# EAGLE design VelcheckPSI_G2 (EAGLE 9.6.2)
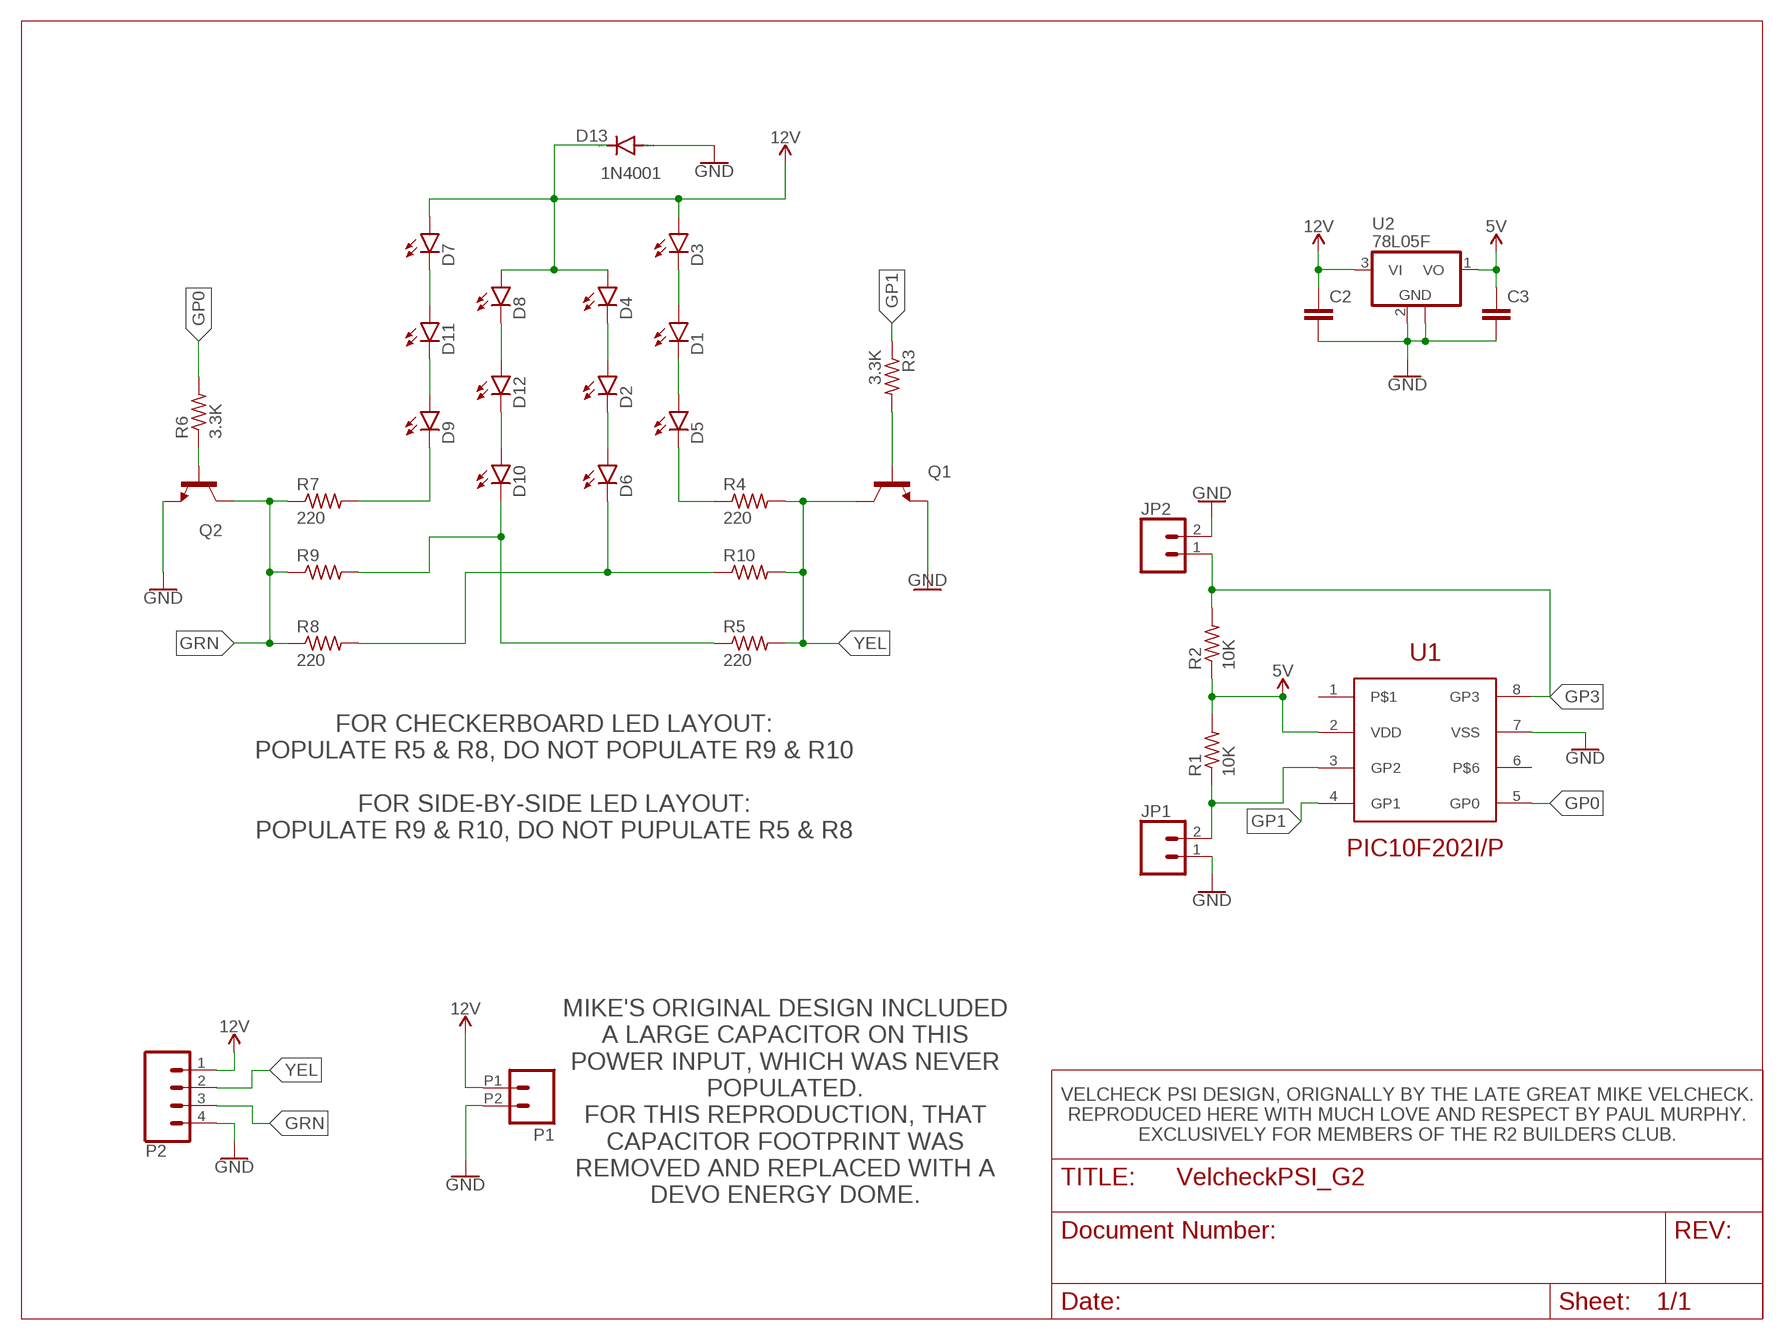
[diagram p0: schematic, sheet 1]

## Parts
C2  C-EUC0805  [C0805]
C3  C-EUC0805  [C0805]
D1  LED5MM  [LED5MM_SLIM]
D2  LED5MM  [LED5MM_SLIM]
D3  LED5MM  [LED5MM_SLIM]
D4  LED5MM  [LED5MM_SLIM]
D5  LED5MM  [LED5MM_SLIM]
D6  LED5MM  [LED5MM_SLIM]
D7  LED5MM  [LED5MM_SLIM]
D8  LED5MM  [LED5MM_SLIM]
D9  LED5MM  [LED5MM_SLIM]
D10  LED5MM  [LED5MM_SLIM]
D11  LED5MM  [LED5MM_SLIM]
D12  LED5MM  [LED5MM_SLIM]
D13  1N4001  DIODE-DO-214AC  [DO-214AC]
JP1  CONN_02  [1X02]
JP2  CONN_02  [1X02]
P1  M022.54MM_SCREWTERM  [1X02_2.54_SCREWTERM]
P2  CONN_04POLAR  [MOLEX-1X4]
Q1  MMBT2222ALT1-NPN-SOT23-BEC  [SOT23-BEC]
Q2  MMBT2222ALT1-NPN-SOT23-BEC  [SOT23-BEC]
R1  10K  R-US_R0603  [R0603]
R2  10K  R-US_R0603  [R0603]
R3  3.3K  R-US_R0603  [R0603]
R4  220  R-US_R0603  [R0603]
R5  220  R-US_R0603  [R0603]
R6  3.3K  R-US_R0603  [R0603]
R7  220  R-US_R0603  [R0603]
R8  220  R-US_R0603  [R0603]
R9  R-US_R0603  [R0603]
R10  R-US_R0603  [R0603]
U1  PIC10F202I/P  [DIP762W53P254L949H508Q8B]
U2  78L05F  [SOT89]

## Nets
5V: C3.1 R1.2 R2.1 U1.2(VDD) U2.1(VO)
12V: C2.1 D3.A D4.A D7.A D8.A D13.C P1.P1 P2.1 U2.3(VI)
GND: C2.2 C3.2 D13.A JP1.1 JP2.2 P1.P2 P2.4 Q1.E Q2.E U1.7(VSS) U2.2(GND) U2.2@1(GND)
GP0: R6.2 U1.5(GP0)
GP1: R3.1 U1.4(GP1)
GP3: JP2.1 R2.2 U1.8(GP3)
GRN: P2.3 Q2.C R7.1 R8.1 R9.1
N$1: Q2.B R6.1
N$2: Q1.B R3.2
N$3: JP1.2 R1.1 U1.3(GP2)
N$6: D5.K(C) R4.1
N$7: D9.K(C) R7.2
N$8: D10.K(C) R5.1 R9.2
N$10: D1.A D3.K(C)
N$11: D2.A D4.K(C)
N$12: D1.K(C) D5.A
N$13: D2.K(C) D6.A
N$15: D6.K(C) R8.2 R10.1
N$16: D7.K(C) D11.A
N$17: D9.A D11.K(C)
N$18: D8.K(C) D12.A
N$20: D10.A D12.K(C)
YEL: P2.2 Q1.C R4.2 R5.2 R10.2
Unconnected: U1.1 U1.6

## Notes on the sheet
- FOR CHECKERBOARD LED LAYOUT:
  POPULATE R5 & R8, DO NOT POPULATE R9 & R10
  
  FOR SIDE-BY-SIDE LED LAYOUT:
  POPULATE R9 & R10, DO NOT PUPULATE R5 & R8
- MIKE'S ORIGINAL DESIGN INCLUDED
  A LARGE CAPACITOR ON THIS
  POWER INPUT, WHICH WAS NEVER
  POPULATED.
  FOR THIS REPRODUCTION, THAT
  CAPACITOR FOOTPRINT WAS
  REMOVED AND REPLACED WITH A
  DEVO ENERGY DOME.
- VELCHECK PSI DESIGN, ORIGNALLY BY THE LATE GREAT MIKE VELCHECK.
  REPRODUCED HERE WITH MUCH LOVE AND RESPECT BY PAUL MURPHY.
  EXCLUSIVELY FOR MEMBERS OF THE R2 BUILDERS CLUB.

## Library data of the parts
C2 C3 = rcl:C-EU: CAPACITOR, European symbol; SPICEPREFIX: C
D1-D12 = rseries:LED: LEDs Thru-hole 3mm and 5mm LEDs used on Teeces logic displays
D13 = diode:DIODE-: DIODE
JP1 JP2 = SparkFun-Connectors:CONN_02: Multi connection point. Often used as Generic Header-pin footprint for 0.1 inch spaced/style header connections On any of the 0.1 inch spaced packages, you can populate with these: Break Away Headers - Straight <https://www.sparkfun.com/products/116> (PRT-00116) Break Away Male Headers - Right Angle <https://www.sparkfun.com/products/553> (PRT-00553) Female Headers <https://www.sparkfun.com/products/115> (PRT-00115) Break Away Headers - Machine Pin <https://www.sparkfun.com/products/117> (PRT-00117) Break Away Female Headers - Swiss Machine Pin <https://www.sparkfun.com/products/743> (PRT-00743) For SCREWTERMINALS and SPRING TERMINALS visit here: Screw Terimnals on SparkFun.com <https://www.sparkfun.com/search/results?term=Screw+Terminals> (5mm/3.5mm/2.54mm spacing) This device is also useful as a general connection point to wire up your design to another part of your project. Our various solder wires solder well into these plated through hole pads. Hook-Up Wire - Assortment (Stranded, 22 AWG) <https://www.sparkfun.com/products/11375> (PRT-11375) Hook-Up Wire - Assortment (Solid Core, 22 AWG) <https://www.sparkfun.com/products/11367> (PRT-11367) View the entire wire category on our website here <https://www.sparkfun.com/categories/141> Special notes: Molex polarized connector foot print use with: PRT-08233 with associated crimp pins and housings. 2.54_SCREWTERM for use with PRT-10571. 3.5mm Screw Terminal footprints for PRT-08084 5mm Screw Terminal footprints for use with PRT-08432
P1 = rseries:M02: Standard 2-pin 0.1" header. Use with - straight break away headers ( PRT-00116) - right angle break away headers (PRT-00553) - swiss pins (PRT-00743) - machine pins (PRT-00117) - female headers (PRT-00115) Molex polarized connector foot print use with: PRT-08233 with associated crimp pins and housings. 2.54_SCREWTERM for use with PRT-10571. 3.5mm Screw Terminal footprints for PRT-08084 5mm Screw Terminal footprints for use with PRT-08432
P2 = SparkFun-Connectors:CONN_04: Multi connection point. Often used as Generic Header-pin footprint for 0.1 inch spaced/style header connections On any of the 0.1 inch spaced packages, you can populate with these: Break Away Headers - Straight <https://www.sparkfun.com/products/116> (PRT-00116) Break Away Male Headers - Right Angle <https://www.sparkfun.com/products/553> (PRT-00553) Female Headers <https://www.sparkfun.com/products/115> (PRT-00115) Break Away Headers - Machine Pin <https://www.sparkfun.com/products/117> (PRT-00117) Break Away Female Headers - Swiss Machine Pin <https://www.sparkfun.com/products/743> (PRT-00743) For SCREWTERMINALS and SPRING TERMINALS visit here: Screw Terimnals on SparkFun.com <https://www.sparkfun.com/search/results?term=Screw+Terminals> (5mm/3.5mm/2.54mm spacing) This device is also useful as a general connection point to wire up your design to another part of your project. Our various solder wires solder well into these plated through hole pads. Hook-Up Wire - Assortment (Stranded, 22 AWG) <https://www.sparkfun.com/products/11375> (PRT-11375) Hook-Up Wire - Assortment (Solid Core, 22 AWG) <https://www.sparkfun.com/products/11367> (PRT-11367) View the entire wire category on our website here <https://www.sparkfun.com/categories/141> Special notes: Molex polarized connector foot print use with SKU : PRT-08231 with associated crimp pins and housings. 1MM SMD Version SKU: PRT-10208; PROD_ID: CONN-08186; SF_ID: PRT-08231
Q1 Q2 = transistor:*-NPN-: NPN Transistror BF959 corrected 2008.03.06
R1-R10 = rcl:R-US_: RESISTOR, American symbol; SPICEPREFIX: R
U1 = rseries:PIC10F202
U2 = linear:78L*: POSITOIV-VOLTAGE REGULATORS Output up to 100 mA Source: Datasheet <http://focus.ti.com/lit/ds/symlink/ua78l05.pdf>

## Board
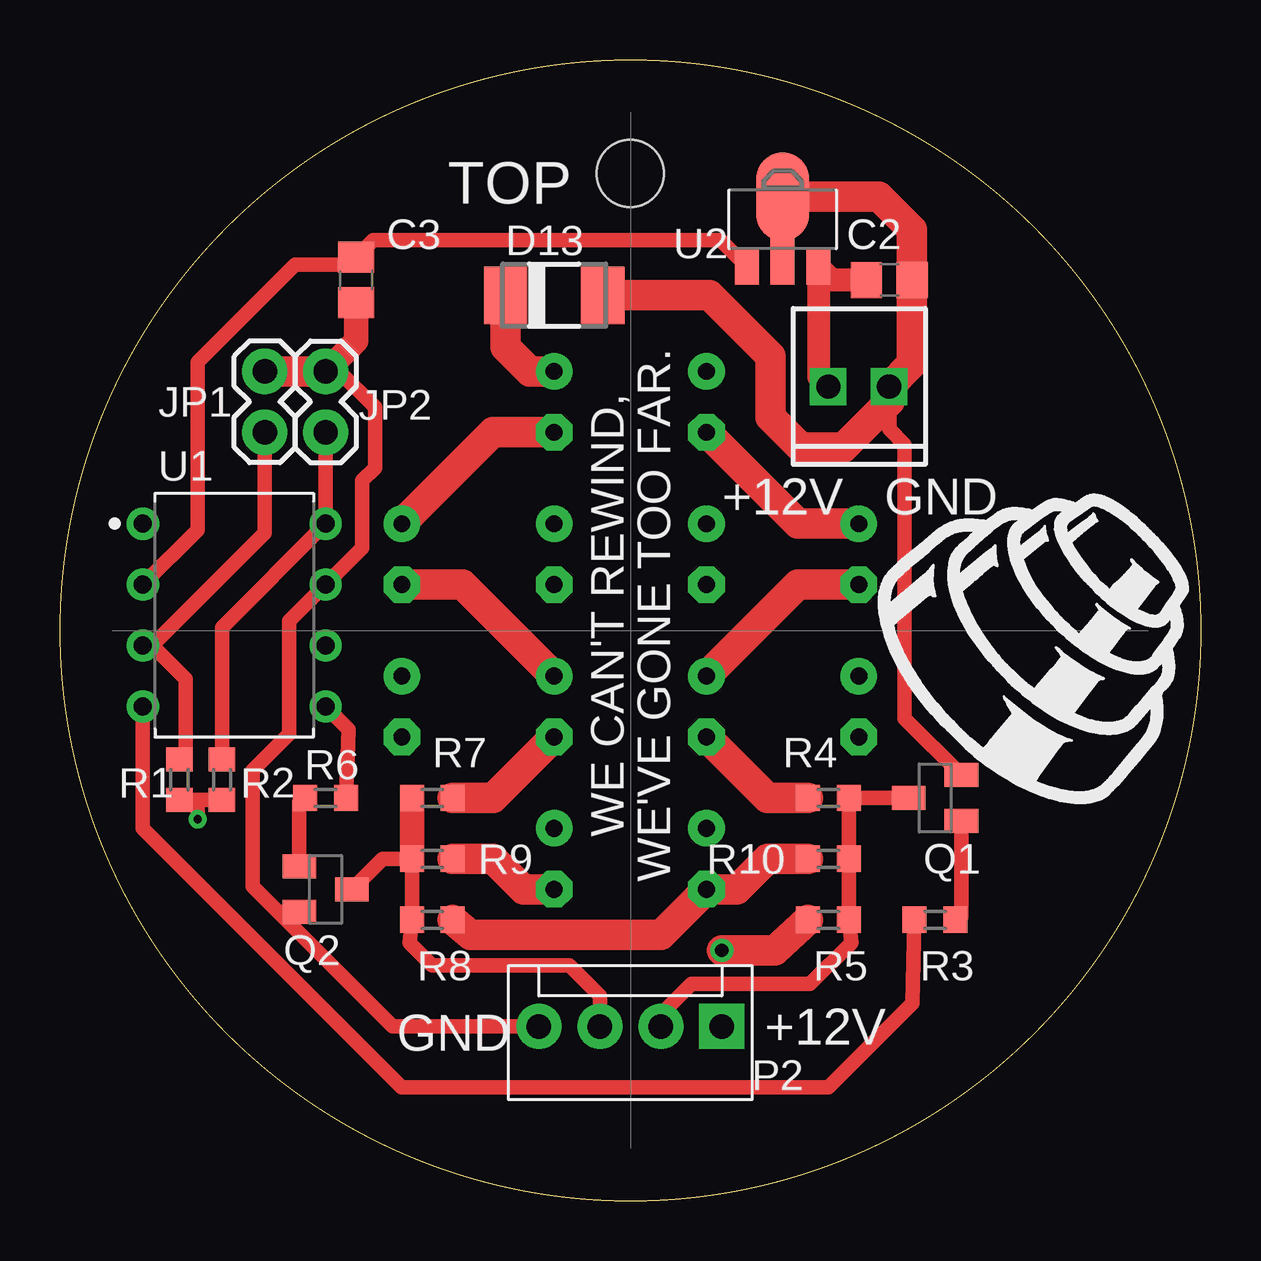
[diagram p1: board, top side]
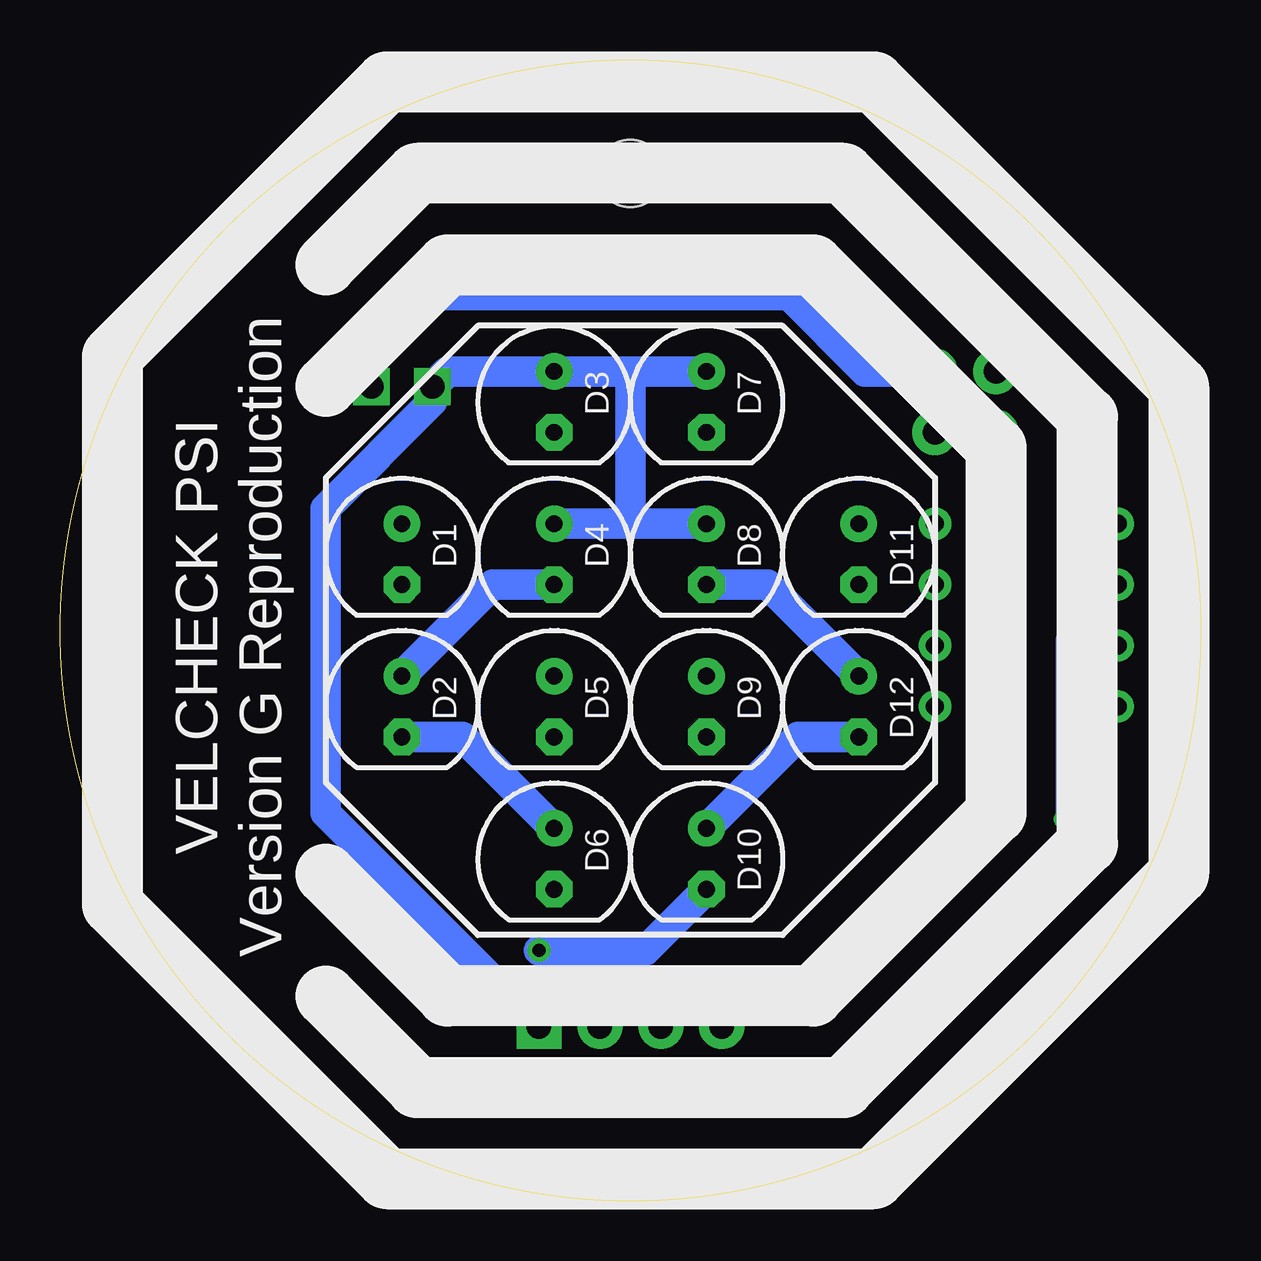
[diagram p2: board, bottom side, seen from below]

Size 47.55 x 47.55 mm. Coordinates in mm from the lower left corner, seen from the top.
Outline: circle at 23.77,23.77 radius 23.77
Copper layers (1*16): Top 0.035mm / dielectric 1.5mm / Bottom 0.035mm
Design rules "default": minimum track width 6mil, minimum drill 0.35mm, track to track 6mil, track to pad 6mil, pad to pad 6mil, via to via 6mil, smd to smd 6mil, copper to edge 40mil, drill to drill 6mil, minimum pad ring 10mil, minimum via ring 8mil, stop-mask expansion 4mil, vias tented up to drill 0mil, thermal gap 10mil
Holes 2.79 mm at 23.77,42.82

### Footprints (pad centres in the part's own frame; a part is rotated, then mirrored left to right if it is on the bottom)
C0805 = smd 1.3 x 1.5: 1 -0.95,0; 2 0.95,0
LED5MM_SLIM = drill 0.7 pad 1.524: A -1.27,0 | drill 0.7 pad 1.524 octagon: K 1.27,0
DO-214AC = smd 1.8 x 2.4: A 2.025,0; C -2.025,0
1X02 = drill 1.016 pad 1.88: 1 0,0; 2 2.54,0
1X02_2.54_SCREWTERM = drill 1.016 square: P1 2.54,0; P2 0,0
MOLEX-1X4 = drill 1.016 pad 1.88 square: 1 0,0 | drill 1.016 pad 1.88: 2 2.54,0; 3 5.08,0; 4 7.62,0
SOT23-BEC = smd 1 x 1.4: B -0.95,-1.1; C 0,1.1; E 0.95,-1.1
R0603 = smd 1 x 1.1: 1 -0.85,0; 2 0.85,0
DIP762W53P254L949H508Q8B = drill 0.743 pad 1.343: 1 -3.81,3.81; 2 -3.81,1.27; 3 -3.81,-1.27; 4 -3.81,-3.81; 5 3.81,-3.81; 6 3.81,-1.27; 7 3.81,1.27; 8 3.81,3.81
SOT89 = smd 1 x 1.5: 1 -1.499,-1.981; 3 1.499,-1.981 | smd 1 x 2: 2 0,-1.727 | smd 2.2 x 3.7: 2@1 0,0.94

### Placement (x,y rotation side)
C2  34.57,38.38 0 top
C3  12.34,38.38 270 top
D1  33.3,26.95 270 bottom
D2  33.3,20.6 270 bottom
D3  26.95,33.3 270 bottom
D4  26.95,26.95 270 bottom
D5  26.95,20.6 270 bottom
D6  26.95,14.25 270 bottom
D7  20.6,33.3 270 bottom
D8  20.6,26.95 270 bottom
D9  20.6,20.6 270 bottom
D10  20.6,14.25 270 bottom
D11  14.25,26.95 270 bottom
D12  14.25,20.6 270 bottom
D13  20.6,37.74 0 top
JP1  8.53,34.57 270 top
JP2  11.07,32.03 90 top
P1  34.57,33.93 180 top
P2  27.58,7.26 180 top
Q1  36.47,16.79 90 top
Q2  11.07,12.98 270 top
R1  4.98,17.55 270 top
R2  6.76,17.55 90 top
R3  36.47,11.71 0 top
R4  32.03,16.79 0 top
R5  32.03,11.71 0 top
R6  11.07,16.79 0 top
R7  15.52,16.79 0 top
R8  15.52,11.71 0 top
R9  15.52,14.25 0 top
R10  32.03,14.25 0 top
U1  7.26,24.41 0 top
U2  30.12,40.92 0 top
U$1  [DEVO]  44.09,26.82 315 top

### Tracks (layer width: path | path; a pad name or v marks a point on that pad's centre or on a via)
5V  (via drill 0.35)
  Top 0.61: U2.1 27.53,40.03 13.05,40.03 C3.1 12.03,39.01 9.8,39.01 5.74,34.95 5.74,27.97 U1.2 | 3.84,25.68 U1.2 | 3.62,25.85 U1.2 | R1.2 5.74,16.7 | 5.74,16.7 R2.1 | v5.74,15.9 5.74,16.7
  Bottom 0.61: U1.2 5.74,23.39 v5.74,15.9
12V
  Top 0.61: 31.62,34.34 P1.P1
  Top 0.965: 31.62,34.34 31.62,37.74 U2.3 32.18,38.38 C2.1
  Top 1.27: P1.P1 32.16,34.06 | D13.C 18.57,35.58 19.58,34.57 D7.A
  Bottom 1.27: P2.1 36.47,16.15 36.47,28.85 32.03,33.3 P1.P1 31.39,34.57 D3.A 23.77,34.57 | D7.A 23.77,34.57 | D4.A 23.77,28.22 | 23.77,28.22 D8.A | 23.77,28.22 23.77,34.57
GND
  Top 0.61: 9.1,12.03 8.03,13.11 8.03,17.93 9.55,19.46 9.55,24.16 U1.7 12.6,27.2 12.6,30.01 13.13,30.54 13.13,33.07 11.63,34.57 JP2.2 | 9.1,12.03 13.87,7.26 P2.4 | Q2.E 9.1,12.03 | 30.38,41.05 30.12,41.3 U2.2@1 U2.2 | P1.P2 34.57,32.16 35.2,31.52 35.2,20.11 Q1.E
  Top 1.016: C3.2 12.34,35.84 JP2.2
  Top 1.27: JP1.1 JP2.2 | D13.A 27.08,37.74 29.62,35.2 29.62,32.66 30.89,31.39 32.66,31.39 34.57,33.3 P1.P2 35.52,34.88 C2.2 35.52,40.48 34.14,41.86 U2.2@1
  Bottom 1.27: P1.P2 34.57,35.2 32.03,37.74 17.17,37.74 14,34.57 JP2.2
GP0
  Top 0.61: R6.2 12.02,19.65 U1.5
GP1
  Top 0.61: R3.1 35.52,8.22 32.03,4.72 14.25,4.72 3.45,15.52 U1.4
GP3
  Top 0.61: JP2.1 U1.8 6.76,23.9 R2.2
GRN
  Top 0.61: P2.3 22.5,8.53 21.23,9.8 15.52,9.8 14.57,10.75 R8.1 R9.1 13.44,14.25 Q2.C
  Top 1.016: R7.1 R9.1
N$1
  Top 0.61: Q2.B 9.97,16.64 R6.1
N$2
  Top 0.61: Q1.B 37.57,11.86 R3.2
N$3
  Top 0.61: 3.84,23.14 5.23,21.74 5.23,18.66 R1.1 | JP1.2 8.53,27.84 3.84,23.14 | 3.84,23.14 U1.3
N$6
  Top 1.27: D5.K 29.49,16.79 R4.1
N$7
  Top 1.27: D9.K 18.06,16.79 R7.2
N$8  (via drill 0.55)
  Top 1.27: D10.K 19.33,12.98 18.06,14.25 R9.2 | R5.1 29.81,10.44 v27.58,10.44
  Bottom 1.27: v27.58,10.44 23.14,10.44 D10.K
N$10
  Top 1.27: D1.A 30.76,28.22 D3.K
N$11
  Bottom 1.27: D2.A 29.49,25.68 D4.K
N$12
  Top 1.27: D5.A 30.76,25.68 D1.K
N$13
  Bottom 1.27: D6.A 30.76,19.33 D2.K
N$15
  Top 1.27: R10.1 29.49,14.25 28.22,12.98 D6.K 25.04,11.07 17.1,11.07 R8.2
N$16
  Top 1.27: D11.A 18.06,32.03 D7.K
N$17
  Top 1.27: D9.A 16.79,25.68 D11.K
N$18
  Bottom 1.27: D12.A 18.06,25.68 D8.K
N$20
  Bottom 1.27: D10.A 16.79,19.33 D12.K
YEL
  Top 0.61: Q1.C R4.2 R10.2 R5.2 32.98,10.75 31.27,9.04 26.31,9.04 25.04,7.77 P2.2

### Text on the board
tPlace: TOP | +12V | GND | WE CAN'T REWIND, / WE'VE GONE TOO FAR. | GND | +12V
bPlace: VELCHECK PSI / Version G Reproduction